# EAGLE design 117_01_TIMER_GATE (EAGLE 9.6.2)
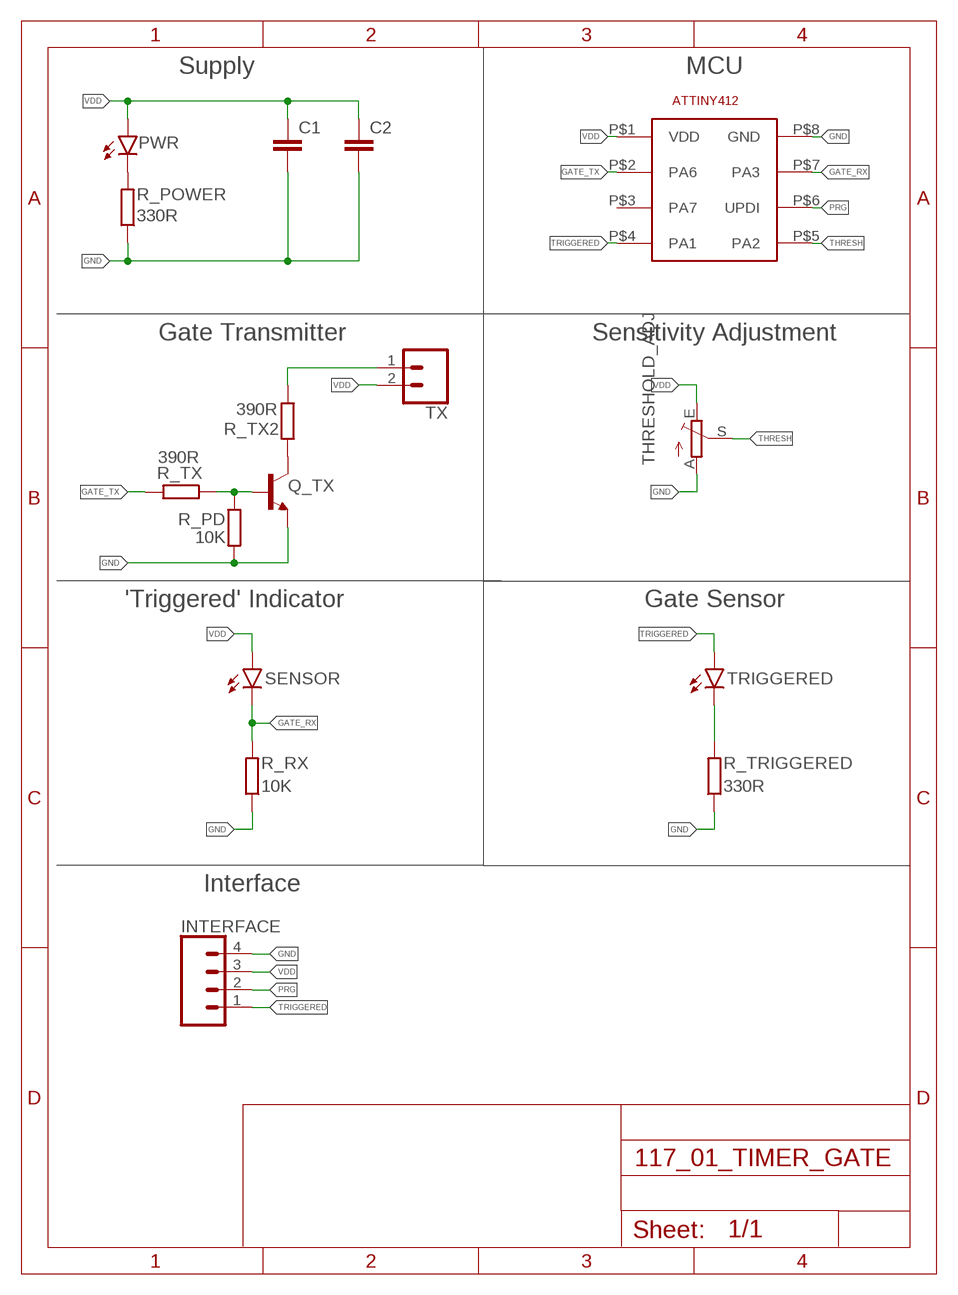
[diagram p0: schematic, sheet 1]

## Parts
C1  C-EUC0805K  [C0805K]
C2  C-EUC0805K  [C0805K]
INTERFACE  CONN_04LONGPADS  [1X04_LONGPADS]
PWR  LEDSML0805  [SML0805]
Q_TX  2N2222-NPN-TO92-EBC  [TO92-EBC]
R_PD  10K  R-EU_M0805  [M0805]
R_POWER  330R  R-EU_M0805  [M0805]
R_RX  10K  R-EU_M0805  [M0805]
R_TRIGGERED  330R  R-EU_M0805  [M0805]
R_TX  390R  R-EU_M0805  [M0805]
R_TX2  390R  R-EU_M0805  [M0805]
SENSOR  LED5MM  [LED_5MM]
THRESHOLD_ADJ  TRIM_EU-S64W  [S64W]
TRIGGERED  LED5MM  [LED_5MM]
TX  CONN_02PTH3  [1X02_LONGPADS]
U$1  ATTINY412  [ATTINY412]

## Nets
GATE_RX: R_RX.2 SENSOR.K(C) U$1.P$7(PA3)
GATE_TX: R_TX.2 U$1.P$2(PA6)
GND: C1.2 C2.2 INTERFACE.4 Q_TX.E R_PD.2 R_POWER.1 R_RX.1 R_TRIGGERED.1 THRESHOLD_ADJ.A U$1.P$8(GND)
N$1: PWR.C R_POWER.2
N$2: R_TX2.1 TX.1
N$4: Q_TX.B R_PD.1 R_TX.1
N$5: Q_TX.C R_TX2.2
N$10: R_TRIGGERED.2 TRIGGERED.K(C)
PRG: INTERFACE.2 U$1.P$6(UPDI)
THRESH: THRESHOLD_ADJ.S U$1.P$5(PA2)
TRIGGERED: INTERFACE.1 TRIGGERED.A U$1.P$4(PA1)
VDD: C1.1 C2.1 INTERFACE.3 PWR.A SENSOR.A THRESHOLD_ADJ.E TX.2 U$1.P$1(VDD)
Unconnected: U$1.P$3(PA7)

## Notes on the sheet
- Supply | MCU
- Gate Transmitter | Sensitivity Adjustment
- 'Triggered' Indicator | Gate Sensor
- Interface

## Library data of the parts
C1 C2 = rcl:C-EU: CAPACITOR, European symbol; SPICEPREFIX: C
INTERFACE = SparkFun-Connectors:CONN_04: Multi connection point. Often used as Generic Header-pin footprint for 0.1 inch spaced/style header connections On any of the 0.1 inch spaced packages, you can populate with these: Break Away Headers - Straight <https://www.sparkfun.com/products/116> (PRT-00116) Break Away Male Headers - Right Angle <https://www.sparkfun.com/products/553> (PRT-00553) Female Headers <https://www.sparkfun.com/products/115> (PRT-00115) Break Away Headers - Machine Pin <https://www.sparkfun.com/products/117> (PRT-00117) Break Away Female Headers - Swiss Machine Pin <https://www.sparkfun.com/products/743> (PRT-00743) For SCREWTERMINALS and SPRING TERMINALS visit here: Screw Terimnals on SparkFun.com <https://www.sparkfun.com/search/results?term=Screw+Terminals> (5mm/3.5mm/2.54mm spacing) This device is also useful as a general connection point to wire up your design to another part of your project. Our various solder wires solder well into these plated through hole pads. Hook-Up Wire - Assortment (Stranded, 22 AWG) <https://www.sparkfun.com/products/11375> (PRT-11375) Hook-Up Wire - Assortment (Solid Core, 22 AWG) <https://www.sparkfun.com/products/11367> (PRT-11367) View the entire wire category on our website here <https://www.sparkfun.com/categories/141> Special notes: Molex polarized connector foot print use with SKU : PRT-08231 with associated crimp pins and housings. 1MM SMD Version SKU: PRT-10208; PROD_ID: CONN-09696
PWR = led:LED: LED OSRAM: - CHIPLED LG R971, LG N971, LY N971, LG Q971, LY Q971, LO R971, LY R971 LH N974, LH R974 LS Q976, LO Q976, LY Q976 LO Q996 - Hyper CHIPLED LW Q18S LB Q993, LB Q99A, LB R99A - SideLED LS A670, LO A670, LY A670, LG A670, LP A670 LB A673, LV A673, LT A673, LW A673 LH A674 LY A675 LS A676, LA A676, LO A676, LY A676, LW A676 LS A679, LY A679, LG A679 - Hyper Micro SIDELED® LS Y876, LA Y876, LO Y876, LY Y876 LT Y87S - SmartLED LW L88C, LW L88S LB L89C, LB L89S, LG L890 LS L89K, LO L89K, LY L89K LS L896, LA L896, LO L896, LY L896 - TOPLED LS T670, LO T670, LY T670, LG T670, LP T670 LSG T670, LSP T670, LSY T670, LOP T670, LYG T670 LG T671, LOG T671, LSG T671 LB T673, LV T673, LT T673, LW T673 LH T674 LS T676, LA T676, LO T676, LY T676, LB T676, LH T676, LSB T676, LW T676 LB T67C, LV T67C, LT T67C, LS T67K, LO T67K, LY T67K, LW E67C LS E67B, LA E67B, LO E67B, LY E67B, LB E67C, LV E67C, LT E67C LW T67C LS T679, LY T679, LG T679 LS T770, LO T770, LY T770, LG T770, LP T770 LB T773, LV T773, LT T773, LW T773 LH T774 LS E675, LA E675, LY E675, LS T675 LS T776, LA T776, LO T776, LY T776, LB T776 LHGB T686 LT T68C, LB T68C - Hyper Mini TOPLED® LB M676 - Mini TOPLED Santana® LG M470 LS M47K, LO M47K, LY M47K Source: http://www.osram.convergy.de LUXEON: - LUMILED® LXK2-PW12-R00, LXK2-PW12-S00, LXK2-PW14-U00, LXK2-PW14-V00 LXK2-PM12-R00, LXK2-PM12-S00, LXK2-PM14-U00 LXK2-PE12-Q00, LXK2-PE12-R00, LXK2-PE12-S00, LXK2-PE14-T00, LXK2-PE14-U00 LXK2-PB12-K00, LXK2-PB12-L00, LXK2-PB12-M00, LXK2-PB14-N00, LXK2-PB14-P00, LXK2-PB14-Q00 LXK2-PR12-L00, LXK2-PR12-M00, LXK2-PR14-Q00, LXK2-PR14-R00 LXK2-PD12-Q00, LXK2-PD12-R00, LXK2-PD12-S00 LXK2-PH12-R00, LXK2-PH12-S00 LXK2-PL12-P00, LXK2-PL12-Q00, LXK2-PL12-R00 Source: www.luxeon.com KINGBRIGHT: KA-3528ASYC Source: www.kingbright.com
Q_TX = transistor-neu-to92:*-NPN-: NPN Transistror
R_PD R_POWER R_RX R_TRIGGERED R_TX R_TX2 = rcl:R-EU_: RESISTOR, European symbol; SPICEPREFIX: R
SENSOR TRIGGERED = SparkFun-LED:LED: LED (Generic) Standard schematic elements and footprints for 5mm, 3mm, 1206, and 0603 sized LEDs. Generic LEDs with no color specified.
THRESHOLD_ADJ = pot:TRIM_EU-: POTENTIOMETER
TX = SparkFun-Connectors:CONN_02: Multi connection point. Often used as Generic Header-pin footprint for 0.1 inch spaced/style header connections On any of the 0.1 inch spaced packages, you can populate with these: Break Away Headers - Straight <https://www.sparkfun.com/products/116> (PRT-00116) Break Away Male Headers - Right Angle <https://www.sparkfun.com/products/553> (PRT-00553) Female Headers <https://www.sparkfun.com/products/115> (PRT-00115) Break Away Headers - Machine Pin <https://www.sparkfun.com/products/117> (PRT-00117) Break Away Female Headers - Swiss Machine Pin <https://www.sparkfun.com/products/743> (PRT-00743) For SCREWTERMINALS and SPRING TERMINALS visit here: Screw Terimnals on SparkFun.com <https://www.sparkfun.com/search/results?term=Screw+Terminals> (5mm/3.5mm/2.54mm spacing) This device is also useful as a general connection point to wire up your design to another part of your project. Our various solder wires solder well into these plated through hole pads. Hook-Up Wire - Assortment (Stranded, 22 AWG) <https://www.sparkfun.com/products/11375> (PRT-11375) Hook-Up Wire - Assortment (Solid Core, 22 AWG) <https://www.sparkfun.com/products/11367> (PRT-11367) View the entire wire category on our website here <https://www.sparkfun.com/categories/141> Special notes: Molex polarized connector foot print use with: PRT-08233 with associated crimp pins and housings. 2.54_SCREWTERM for use with PRT-10571. 3.5mm Screw Terminal footprints for PRT-08084 5mm Screw Terminal footprints for use with PRT-08432
U$1 = Stephen:ATTINY412

## Board
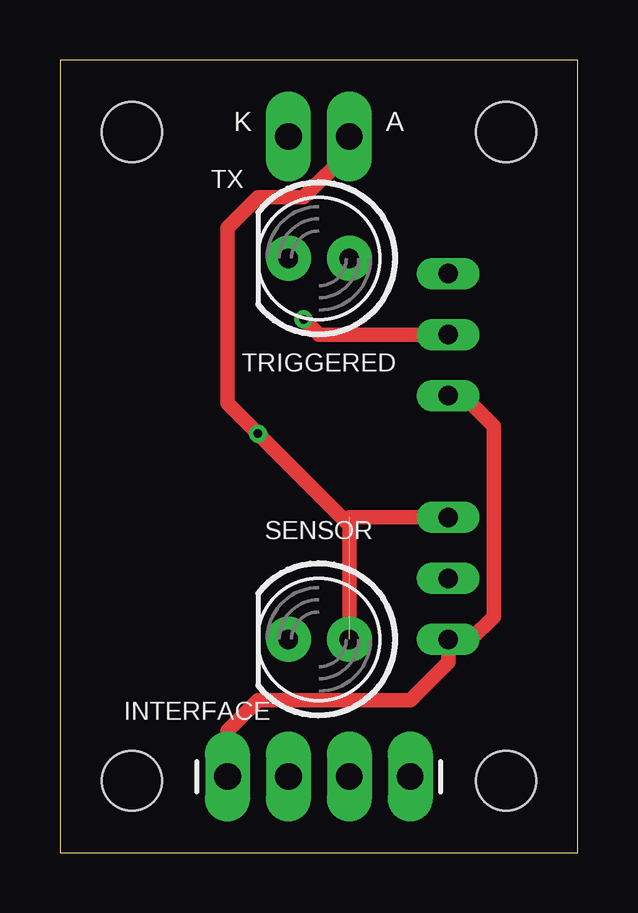
[diagram p1: board, top side]
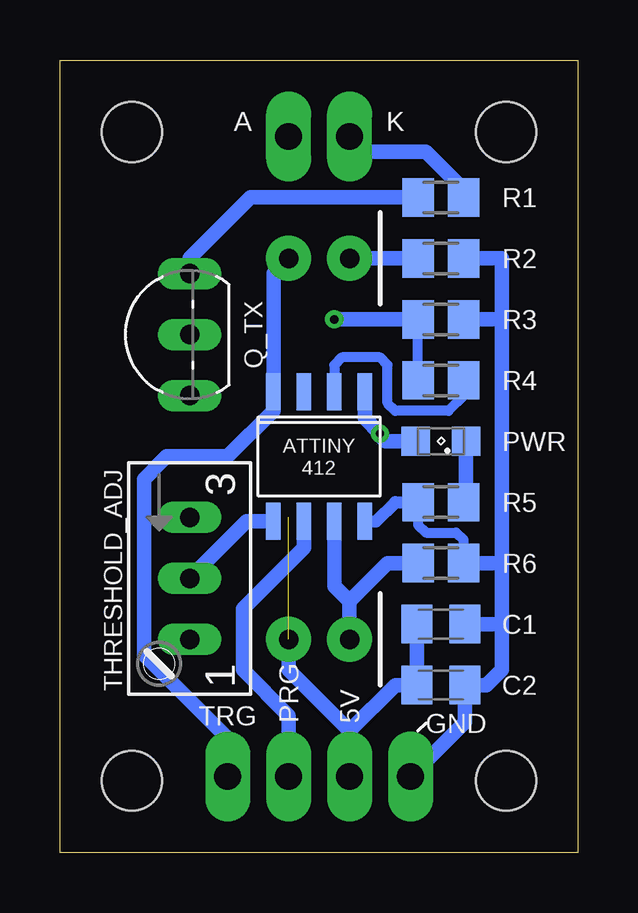
[diagram p2: board, bottom side, seen from below]

Size 21.6 x 33.03 mm. Coordinates in mm from the lower left corner, seen from the top.
Outline: 0,0 21.6,0 21.6,33.03 0,33.03 0,0
Copper layers (1*16): Top 0.035mm / dielectric 1.5mm / Bottom 0.035mm
Design rules "default *": minimum track width 6mil, minimum drill 0.35mm, track to track 6mil, track to pad 6mil, pad to pad 6mil, via to via 6mil, smd to smd 6mil, copper to edge 40mil, drill to drill 6mil, minimum pad ring 10mil, minimum via ring 8mil, stop-mask expansion 4mil, vias tented up to drill 50mil, thermal gap 10mil
Holes 2.5 mm at 18.6,3 18.6,30.03 3,30.03 3,3

### Footprints (pad centres in the part's own frame; a part is rotated, then mirrored left to right if it is on the bottom)
C0805K = smd 1.3 x 1.6: 1 -1,0; 2 1,0
1X04_LONGPADS = drill 1.118 pad 1.88 long: 1 0,0; 2 2.54,0; 3 5.08,0; 4 7.62,0
SML0805 = smd 1.2 x 1.2: A 1.05,0; C -1.05,0
TO92-EBC = drill 0.813 long: B 0,-1.27; C 2.54,-1.27; E -2.54,-1.27
M0805 = smd 1.3 x 1.6: 1 -0.95,0; 2 0.95,0
LED_5MM = drill 0.813 pad 1.88: A -1.27,0; K 1.27,0
S64W = drill 0.813 long: A 2.54,1.27; E -2.54,1.27; S 0,1.27
1X02_LONGPADS = drill 1.118 pad 1.88 long: 1 0,0; 2 2.54,0
ATTINY412 = smd 1.55 x 0.6: P$1 -2.7,1.905; P$2 -2.7,0.635; P$3 -2.7,-0.635; P$4 -2.7,-1.905; P$5 2.7,-1.905; P$6 2.7,-0.635; P$7 2.7,0.635; P$8 2.7,1.905

### Placement (x,y rotation side)
C1  5.71,9.53 0 bottom
C2  5.71,6.99 0 bottom
INTERFACE  14.61,3.17 180 top
PWR  5.71,17.14 180 bottom
Q_TX  17.46,21.59 90 bottom
R_PD  5.71,22.23 0 bottom
R_POWER  5.71,14.61 0 bottom
R_RX  5.71,12.06 180 bottom
R_TRIGGERED  5.71,24.77 180 bottom
R_TX  5.71,19.68 0 bottom
R_TX2  5.71,27.3 180 bottom
SENSOR  10.79,8.89 180 top
THRESHOLD_ADJ  17.46,11.43 270 bottom
TRIGGERED  10.79,24.77 180 top
TX  9.53,29.84 0 top
U$1  10.79,16.51 270 bottom

### Tracks (layer width: path | path; a pad name or v marks a point on that pad's centre or on a via)
GATE_RX
  Bottom 0.152: U$1.P$7 10.31,13.65
  Bottom 0.61: U$1.P$7 10.16,11.11 9.53,10.48 SENSOR.K 9.53,10.47 7.93,12.06 R_RX.2
GATE_TX
  Bottom 0.406: R_TX.2 4.76,19.05 5.4,18.41 7.62,18.41 7.94,18.73 7.94,20.32 8.26,20.64 9.84,20.64 10.16,20.32 U$1.P$2
GND
  Top 0.61: INTERFACE.4 6.99,5.08 8.26,6.35 14.61,6.35 16.19,7.94 THRESHOLD_ADJ.A 17.14,8.89 18.1,9.84 18.1,17.78 16.83,19.05 Q_TX.E
  Bottom 0.152: 4.76,12.71 R_RX.1 4.76,11.47 | 6.67,15.23 R_POWER.1
  Bottom 0.406: R_RX.1 4.76,13.02 5.08,13.34 6.35,13.34 6.67,13.65 R_POWER.1
  Bottom 0.508: U$1.P$8 8.41,13.81 7.62,14.61 R_POWER.1
  Bottom 0.61: 4.45,12.06 R_RX.1 3.17,12.06 | R_TRIGGERED.1 3.17,24.77 3.17,20.32 3.17,19.68 | R_PD.2 3.17,22.23 3.17,19.68 | 3.17,19.68 3.17,12.7 3.17,12.06 | 3.17,12.06 3.17,11.43 3.17,10.16 3.17,9.53 | 3.17,9.53 3.17,8.89 3.17,7.62 3.81,6.99 C2.2 4.71,5.45 INTERFACE.4 | C1.2 3.17,9.53
N$1
  Bottom 0.61: R_POWER.2 4.67,14.71 PWR.C
N$2
  Bottom 0.61: R_TX2.1 4.76,27.62 6.35,29.21 8.89,29.21 TX.1
N$4  (via drill 0.35)
  Top 0.61: Q_TX.B 10.79,21.59 v10.16,22.23
  Bottom 0.406: R_TX.1 R_PD.1
  Bottom 0.61: R_PD.1 v10.16,22.23
N$5
  Bottom 0.61: R_TX2.2 6.98,27.3 13.65,27.3 16.19,24.77 Q_TX.C
N$10
  Bottom 0.61: TRIGGERED.K R_TRIGGERED.2
PRG
  Bottom 0.61: U$1.P$6 11.43,12.7 13.97,10.16 13.97,7.62 12.06,5.71 INTERFACE.2
THRESH
  Bottom 0.61: THRESHOLD_ADJ.S 13.81,13.81 U$1.P$5
TRIGGERED
  Bottom 0.61: TRIGGERED.A 12.7,24.13 U$1.P$4 12.7,18.41 14.61,16.51 17.14,16.51 18.1,15.56 18.1,8.26 14.61,4.76 INTERFACE.1
VDD  (via drill 0.35)  (1 unrouted)
  Top 0.61: TX.2 12.06,29.21 10.16,27.3 8.26,27.3 6.99,26.04 6.99,18.73 v8.26,17.46 12.06,13.65 SENSOR.A | THRESHOLD_ADJ.E 12.06,13.97
  Bottom 0.61: C1.1 C2.1 7.62,6.99 9.53,5.08 | 9.53,5.08 INTERFACE.3 | SENSOR.A 12.06,7.62 9.53,5.08 | PWR.A 8.04,17.14 8.26,17.36 v8.26,17.46 8.89,18.1 U$1.P$1

### Text on the board
bPlace: TRG | GND | 5V | PRG
tNames: K | A
bNames: K | A | R1 | R2 | R3 | R4 | R5 | R6